# EAGLE design controller (EAGLE 6.6.0)
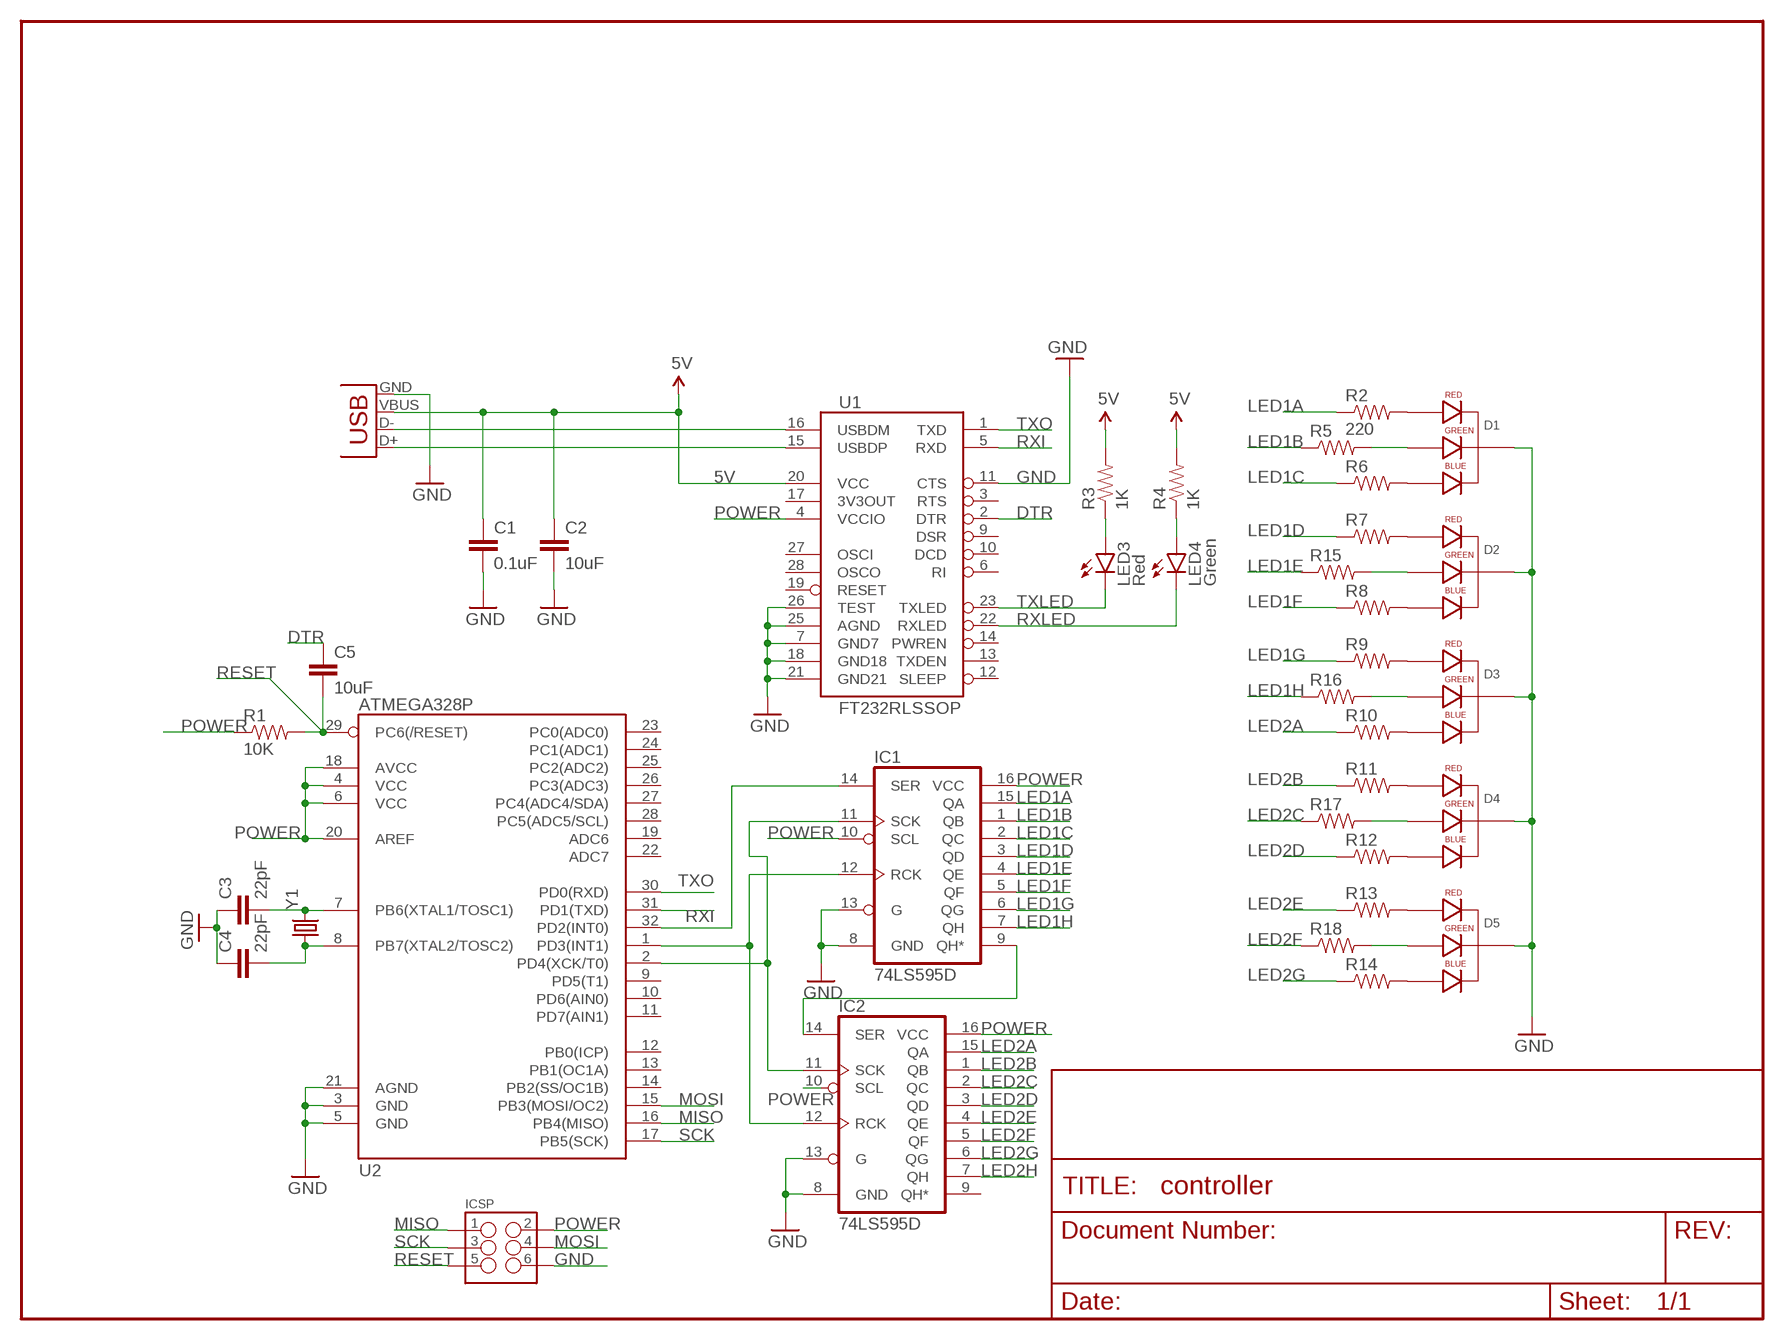
[diagram p0: schematic, sheet 1]

## Parts
C1  0.1uF  CAP0805  [0805]
C2  10uF  CAP0805  [0805]
C3  22pF  CAP0805  [0805]
C4  22pF  CAP0805  [0805]
C5  10uF  CAP0805  [0805]
D1  LED-RGB-CC-THRUDIFFUSE  [LED-RGB-THRU]
D2  LED-RGB-CC-THRUDIFFUSE  [LED-RGB-THRU]
D3  LED-RGB-CC-THRUDIFFUSE  [LED-RGB-THRU]
D4  LED-RGB-CC-THRUDIFFUSE  [LED-RGB-THRU]
D5  LED-RGB-CC-THRUDIFFUSE  [LED-RGB-THRU]
IC1  74LS595D  [SO16]
IC2  74LS595D  [SO16]
ICSP  M03X2POGO_PINS  [2X3_POGO]
LED3  Red  LED1206  [LED-1206]
LED4  Green  LED1206  [LED-1206]
R1  10K  RESISTOR0805-RES  [0805]
R2  220  RESISTOR0805-RES  [0805]
R3  1K  RESISTOR0805-RES  [0805]
R4  1K  RESISTOR0805-RES  [0805]
R5  RESISTOR0805-RES  [0805]
R6  RESISTOR0805-RES  [0805]
R7  RESISTOR0805-RES  [0805]
R8  RESISTOR0805-RES  [0805]
R9  RESISTOR0805-RES  [0805]
R10  RESISTOR0805-RES  [0805]
R11  RESISTOR0805-RES  [0805]
R12  RESISTOR0805-RES  [0805]
R13  RESISTOR0805-RES  [0805]
R14  RESISTOR0805-RES  [0805]
R15  RESISTOR0805-RES  [0805]
R16  RESISTOR0805-RES  [0805]
R17  RESISTOR0805-RES  [0805]
R18  RESISTOR0805-RES  [0805]
U1  FT232RLSSOP  [SSOP28DB]
U2  ATMEGA328P  ATMEGA328_SMT  [TQFP32-08]
X2  USB-SMD-NS  [USB-MINIB-NOSTOP]
Y1  CRYSTALHC49US  [HC49US]

## Nets
5V: C1.1 C2.1 R3.2 R4.2 U1.20(VCC) X2.VBUS
DTR: C5.1 U1.2(DTR)
GND [power]: C1.2 C2.2 C3.1 C4.1 D1.2(CATHODE) D2.2(CATHODE) D3.2(CATHODE) D4.2(CATHODE) D5.2(CATHODE) IC1.8(GND) IC1.13(G) IC2.8(GND) IC2.13(G) ICSP.P$6 U1.7(GND7) U1.11(CTS) U1.18(GND18) U1.21(GND21) U1.25(AGND) U1.26(TEST) U2.3(GND) U2.5(GND) U2.21(AGND) X2.GND
LED1A: IC1.15(QA) R2.1
LED1B: IC1.1(QB) R5.1
LED1C: IC1.2(QC) R6.1
LED1D: IC1.3(QD) R7.1
LED1E: IC1.4(QE) R15.1
LED1F: IC1.5(QF) R8.1
LED1G: IC1.6(QG) R9.1
LED1H: IC1.7(QH) R16.1
LED2A: IC2.15(QA) R10.1
LED2B: IC2.1(QB) R11.1
LED2C: IC2.2(QC) R17.1
LED2D: IC2.3(QD) R12.1
LED2E: IC2.4(QE) R13.1
LED2F: IC2.5(QF) R18.1
LED2G: IC2.6(QG) R14.1
LED2H: IC2.7(QH)
MISO: ICSP.P$1 U2.16(PB4(MISO))
MOSI: ICSP.P$4 U2.15(PB3(MOSI/OC2))
N$1: LED3.A R3.1
N$2: LED4.A R4.1
N$3: IC1.9(QH*) IC2.14(SER)
N$4: IC1.14(SER) U2.32(PD2(INT0))
N$5: IC1.12(RCK) IC2.12(RCK) U2.1(PD3(INT1))
N$6: IC1.11(SCK) IC2.11(SCK) U2.2(PD4(XCK/T0))
N$7: C3.2 U2.7(PB6(XTAL1/TOSC1)) Y1.2
N$8: C4.2 U2.8(PB7(XTAL2/TOSC2)) Y1.1
N$9: D1.1(RED_CATHODE) R2.2
N$10: D1.4(BLUE_CATHODE) R6.2
N$11: D2.1(RED_CATHODE) R7.2
N$12: D2.4(BLUE_CATHODE) R8.2
N$13: D3.1(RED_CATHODE) R9.2
N$14: D3.4(BLUE_CATHODE) R10.2
N$15: D4.1(RED_CATHODE) R11.2
N$16: D4.4(BLUE_CATHODE) R12.2
N$17: D5.1(RED_CATHODE) R13.2
N$18: D5.4(BLUE_CATHODE) R14.2
N$19: D1.3(GREEN_CATHODE) R5.2
N$20: D2.3(GREEN_CATHODE) R15.2
N$21: D3.3(GREEN_CATHODE) R16.2
N$22: D4.3(GREEN_CATHODE) R17.2
N$23: D5.3(GREEN_CATHODE) R18.2
POWER: IC1.10(SCL) IC1.16(VCC) IC2.10(SCL) IC2.16(VCC) ICSP.P$2 R1.1 U1.4(VCCIO) U2.4(VCC) U2.6(VCC) U2.18(AVCC) U2.20(AREF)
RESET: C5.2 ICSP.P$5 R1.2 U2.29(PC6(/RESET))
RXI: U1.5(RXD) U2.31(PD1(TXD))
RXLED: LED4.C U1.22(RXLED)
SCK: ICSP.P$3 U2.17(PB5(SCK))
TXLED: LED3.C U1.23(TXLED)
TXO: U1.1(TXD) U2.30(PD0(RXD))
USB_D+: U1.15(USBDP) X2.D+
USB_D-: U1.16(USBDM) X2.D-
Unconnected: IC2.9(QH*) U1.3(RTS) U1.6(RI) U1.9(DSR) U1.10(DCD) U1.12(SLEEP) U1.13(TXDEN) U1.14(PWREN) U1.17(3V3OUT) U1.19(RESET) U1.27(OSCI) U1.28(OSCO) U2.9(PD5(T1)) U2.10(PD6(AIN0)) U2.11(PD7(AIN1)) U2.12(PB0(ICP)) U2.13(PB1(OC1A)) U2.14(PB2(SS/OC1B)) U2.19(ADC6) U2.22(ADC7) U2.23(PC0(ADC0)) U2.24(PC1(ADC1)) U2.25(PC2(ADC2)) U2.26(PC3(ADC3)) U2.27(PC4(ADC4/SDA)) U2.28(PC5(ADC5/SCL))

## Library data of the parts
C1-C5 = SparkFun-Capacitors:CAP: Capacitor Standard 0603 ceramic capacitor, and 0.1" leaded capacitor.
D1-D5 = SparkFun-LED:LED-RGB-CC-THRU: RGB Through-hole common cathode LED SparkFun Storefront: COM-00105 (Clear) COM-09264 (Diffuse); PROD_ID: DIO-09434
IC1 IC2 = SparkFun-DigitalIC:74*595: 8-bit SHIFT REGISTER, output latch; PROD_ID: IC-07875
ICSP = SparkFun-Connectors:M03X2: 2x3 .1" header. Shrouded, with keying- CONN-10681 SMT- CONN-11415 Pogo pins- HW-11044; PROD_ID: HW-11044
LED3 LED4 = SparkFun-LED:LED: LEDs Standard schematic elements and footprints for 5mm, 3mm, 1206, and 0603 sized LEDs. 5mm - Spark Fun Electronics SKU : COM-00529 (and others)
R1-R18 = SparkFun-Resistors:RESISTOR: Resistor Basic schematic elements and footprints for 0603, 1206, and PTH resistors.
U1 = SparkFun:FT232RL: USB UART FT232RL 4th Generation USB UART (USB <-> Serial) Controller. Spark Fun Electronics SKU : COM-00650
U2 = SparkFun-DigitalIC:ATMEGA328_SMT: 32-Pin Atmega328 part Commonly used on Arduino compatible boards Available in QFP and QFN packages TQFP is IC-09069 QFN is non-stock; PROD_ID: IC-09069
X2 = SparkFun:USB: USB Connectors USB-B-PTH is fully proven SKU : PRT-00139 USB-miniB is fully proven SKU : PRT-00587 USB-A-PCB is untested. USB-A-H is throughly reviewed, but untested. Spark Fun Electronics SKU : PRT-00437 USB-B-SMT is throughly reviewed, but untested. Needs silkscreen touching up. USB-A-S has not been used/tested USB-MB-H has not been used/tested
Y1 = SparkFun-FreqCtrl:CRYSTAL: Various standard crystals. Proven footprints. Spark Fun Electronics SKU : COM-00534

## Net classes
0 default: width 0.203 mm
1 power: width 0.254 mm

## Board
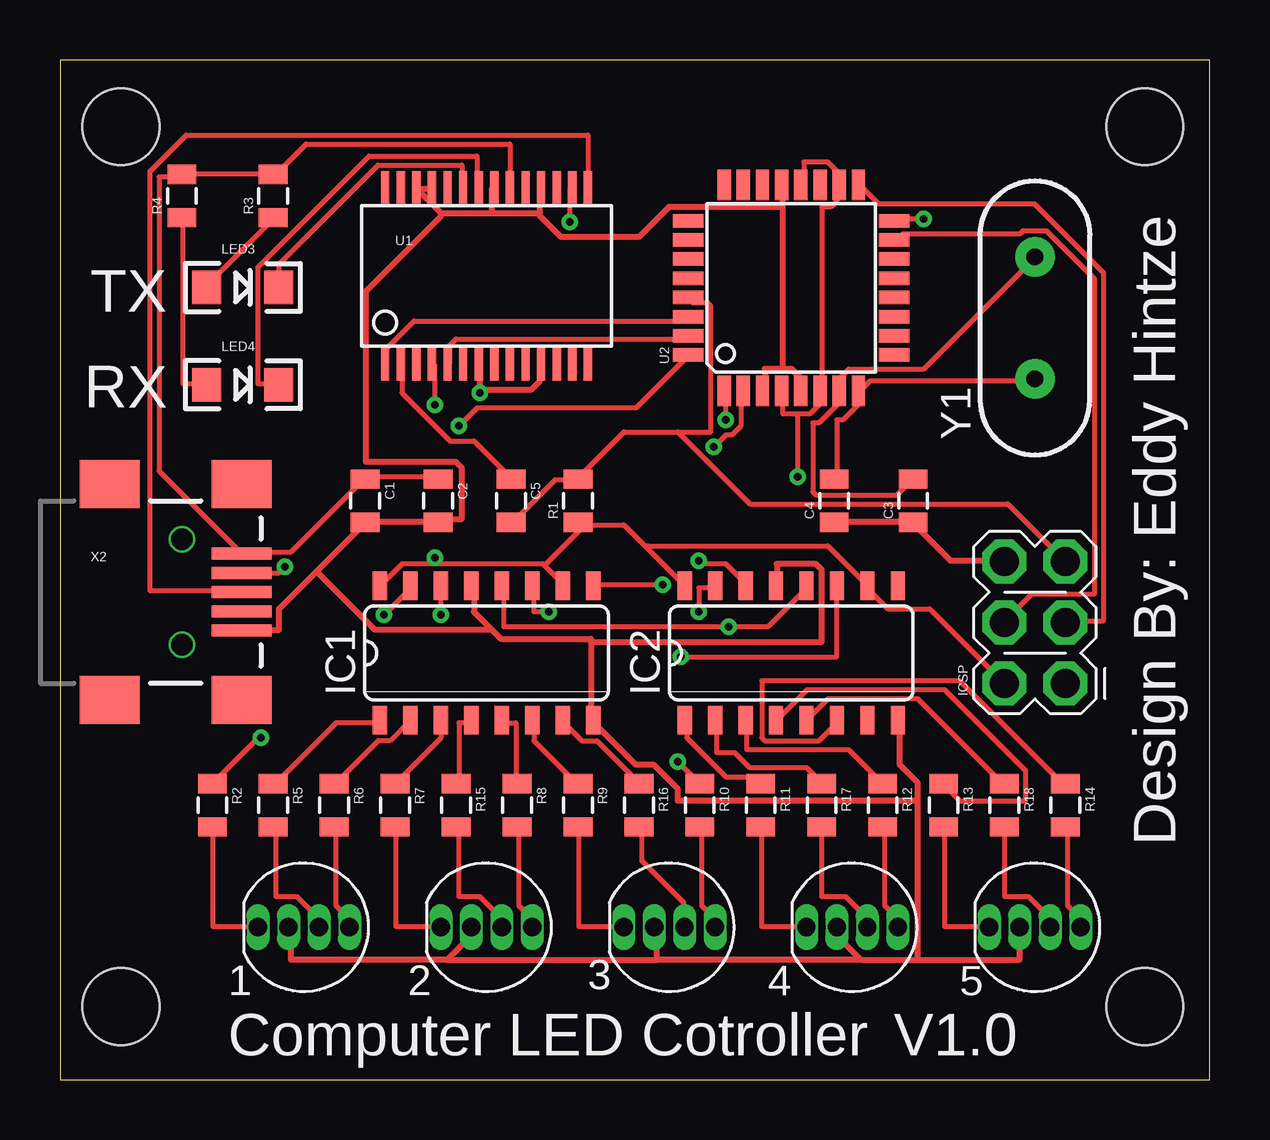
[diagram p1: board, top side]
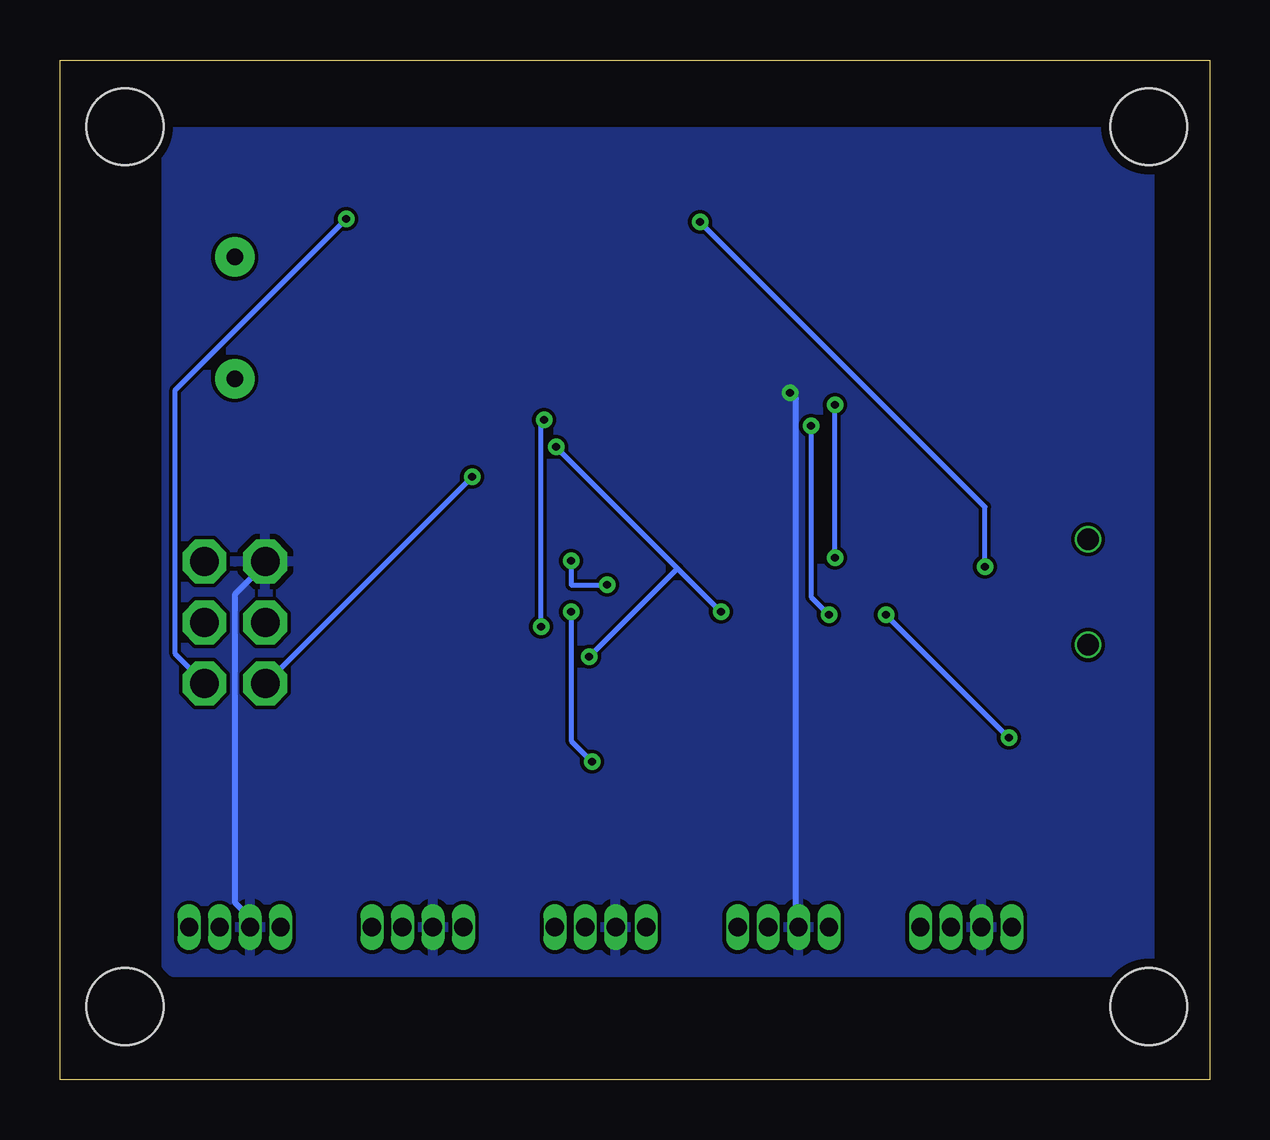
[diagram p2: board, bottom side, seen from below]

Size 47.93 x 42.5 mm. Coordinates in mm from the lower left corner, seen from the top.
Outline: 0,0 47.93,0 47.93,42.5 0,42.5 0,0
Copper layers (1*16): Top 0.0356mm / dielectric 1.5011mm / Bottom 0.0356mm
Design rules "LaenPCBOrder *": minimum track width 6mil, minimum drill 13mil, track to track 6mil, track to pad 6mil, pad to pad 6mil, via to via 6mil, smd to smd 6mil, copper to edge 15mil, drill to drill 6mil, minimum pad ring 4mil, minimum via ring 7mil, stop-mask expansion 3mil, vias tented up to drill 0mil, thermal gap 10mil
Holes 3.2 mm at 2.54,3.04 45.22,3.04 2.54,39.72 45.22,39.72

### Footprints (pad centres in the part's own frame; a part is rotated, then mirrored left to right if it is on the bottom)
0805 = smd 0.8 x 1.2: 1 -0.9,0; 2 0.9,0
LED-RGB-THRU = drill 0.762 pad 0.889 long: 1 1.905,0; 2 0.635,0; 3 -0.635,0; 4 -1.905,0
SO16 = smd 0.6 x 1.2: 1 -4.445,-2.8; 2 -3.175,-2.8; 3 -1.905,-2.8; 4 -0.635,-2.8; 5 0.635,-2.8; 6 1.905,-2.8; 7 3.175,-2.8; 8 4.445,-2.8; 9 4.445,2.8; 10 3.175,2.8; 11 1.905,2.8; 12 0.635,2.8; 13 -0.635,2.8; 14 -1.905,2.8; 15 -3.175,2.8; 16 -4.445,2.8
2X3_POGO = drill 1.2 pad 1.829 octagon: P$1 0,0; P$2 0,2.54; P$3 2.54,0; P$4 2.54,2.54; P$5 5.08,0; P$6 5.08,2.54
LED-1206 = smd 1.2 x 1.4: A -1.5,0; C 1.5,0
SSOP28DB = smd 0.348 x 1.397: 1 -4.225,-3.656; 2 -3.575,-3.656; 3 -2.925,-3.656; 4 -2.275,-3.656; 5 -1.625,-3.656; 6 -0.975,-3.656; 7 -0.325,-3.656; 8 0.325,-3.656; 9 0.975,-3.656; 10 1.625,-3.656; 11 2.275,-3.656; 12 2.925,-3.656; 13 3.575,-3.656; 14 4.225,-3.656; 15 4.225,3.656; 16 3.575,3.656; 17 2.925,3.656; 18 2.275,3.656; 19 1.625,3.656; 20 0.975,3.656; 21 0.325,3.656; 22 -0.325,3.656; 23 -0.975,3.656; 24 -1.625,3.656; 25 -2.275,3.656; 26 -2.925,3.656; 27 -3.575,3.656; 28 -4.225,3.656
TQFP32-08 = smd 1.27 x 0.559: 1 -4.293,2.8; 2 -4.293,2; 3 -4.293,1.2; 4 -4.293,0.4; 5 -4.293,-0.4; 6 -4.293,-1.2; 7 -4.293,-2; 8 -4.293,-2.8; 17 4.293,-2.8; 18 4.293,-2; 19 4.293,-1.2; 20 4.293,-0.4; 21 4.293,0.4; 22 4.293,1.2; 23 4.293,2; 24 4.293,2.8 | smd 0.559 x 1.27: 9 -2.8,-4.293; 10 -2,-4.293; 11 -1.2,-4.293; 12 -0.4,-4.293; 13 0.4,-4.293; 14 1.2,-4.293; 15 2,-4.293; 16 2.8,-4.293; 25 2.8,4.293; 26 2,4.293; 27 1.2,4.293; 28 0.4,4.293; 29 -0.4,4.293; 30 -1.2,4.293; 31 -2,4.293; 32 -2.8,4.293
USB-MINIB-NOSTOP = smd 2.5 x 0.5: D+ 2.5,0; D- 2.5,0.8; GND 2.5,-1.6; ID 2.5,-0.8; VBUS 2.5,1.6 | smd 2.5 x 2: G1 -3,-4.5; G2 -3,4.5; G3 2.5,4.5; G4 2.5,-4.5 | drill 0.9 pad 0.8: H1 0,2.2 | drill 0.9 pad 0.787: H2 0,-2.2
HC49US = drill 0.7 pad 1.651: 1 -2.54,0; 2 2.54,0

### Placement (x,y rotation side)
C1  12.72,24.13 270 top
C2  15.76,24.13 270 top
C3  35.56,24.13 90 top
C4  32.27,24.13 90 top
C5  18.8,24.13 270 top
D1  10.16,6.35 180 top
D2  17.78,6.35 180 top
D3  25.4,6.35 180 top
D4  33.02,6.35 180 top
D5  40.64,6.35 180 top
IC1  17.78,17.78 0 top
IC2  30.48,17.78 0 top
ICSP  41.91,16.51 90 top
LED3  7.62,33.02 0 top
LED4  7.62,28.96 0 top
R1  21.59,24.13 90 top
R2  6.35,11.43 270 top
R3  8.89,36.83 90 top
R4  5.08,36.83 90 top
R5  8.89,11.43 270 top
R6  11.43,11.43 270 top
R7  13.97,11.43 270 top
R8  19.05,11.43 270 top
R9  21.59,11.43 270 top
R10  26.67,11.43 270 top
R11  29.21,11.43 270 top
R12  34.29,11.43 270 top
R13  36.83,11.43 270 top
R14  41.91,11.43 270 top
R15  16.51,11.43 270 top
R16  24.13,11.43 270 top
R17  31.75,11.43 270 top
R18  39.37,11.43 270 top
U1  17.78,33.5 0 top
U2  30.48,33 90 top
X2  5.08,20.32 0 top
Y1  40.64,31.75 90 top

### Tracks (layer width: path | path; a pad name or v marks a point on that pad's centre or on a via)
5V
  Top 0.203: C2.1 15.75,25.12 12.75,25.12 C1.1 12.62,25 9.62,22 7.62,22 X2.VBUS 4.12,25.38 4.12,37.62 5,37.62 R4.2 5.12,37.75 8.88,37.75 R3.2 9,37.75 10.25,39 18.75,39 18.75,37.25 U1.20
DTR
  Top 0.203: C5.1 18.75,25.12 17.25,26.62 16.25,26.62 14.25,28.62 14.25,29.75 U1.2
GND  (via drill 0.33)
  Top 0.254: U1.25 15.5,37.12 14.88,37.12 U1.26 15,37 15.88,36.12 | 18,36.12 18,37.12 U1.21 | 15.88,36.12 18,36.12 | 20,36.12 20,37.12 U1.18 | 18,36.12 20,36.12 | 30.12,29.62 30.5,29.62 30.88,29.25 30.88,28.75 U2.5 | 30.12,29.62 29.38,29.62 29.38,28.75 U2.3 | 30.12,29.62 30.12,36.38 | 30.12,36.38 30.12,37.25 U2.21 | 30.12,36.38 25.38,36.38 24.12,35.12 20.88,35.12 20,36 20,36.12 | 10.69,21.19 9.12,19.62 9.12,18.75 7.62,18.75 X2.GND | 10.69,21.19 12.62,23.12 C1.2 12.75,23.25 15.75,23.25 C2.2 15.75,23.38 16.75,23.38 16.75,25.5 16.5,25.75 12.75,25.75 12.75,32.88 15.88,36 15.88,36.12 | 22.12,18.25 22.12,18.38 18.38,18.38 17.94,18.81 | 22.12,18.25 22.12,15 IC1.8 22.25,14.88 24,13.12 24.75,13.12 25.75,12.12 25.75,11.62 35.75,11.62 | 17.94,18.81 17.25,19.5 17.25,20.5 IC1.13 | 22.12,18.25 31.75,18.25 31.75,21.25 31.5,21.5 29.88,21.5 29.88,20.62 IC2.13 | 10.69,21.19 13.12,18.75 17.88,18.75 17.94,18.81 | C4.1 32.38,23.25 35.5,23.25 C3.1 35.62,23.12 37.12,21.62 39.25,21.62 ICSP.P$6 | 35.75,5 35.75,11.62 | 35.75,11.62 35.75,12.38 35,13.12 35,14.88 IC2.8 | 33.38,5 35.75,5 | 33.38,5 32.5,5.88 32.5,6.25 D4.2 | 24.88,5 24.88,6.25 D3.2 | 33.38,5 24.88,5 | 35.75,5 40,5 40,6.25 D5.2 | 17.5,28.75 17.5,29.75 U1.7 | 17.5,28.75 19.62,28.75 20,29.12 20,29.75 U1.11 | 16.12,5 9.62,5 9.62,6.25 D1.2 | 16.12,5 17.12,6 17.12,6.25 D2.2 | v17.5,28.62 17.5,28.75 | 16.12,5 24.88,5
  Bottom 0.254: ICSP.P$6 39.38,21.5 40.62,20.25 40.62,7.38 40.12,6.88 40.12,6.38 D5.2 | v17.5,28.62 17.25,28.38 17.25,6.38 D2.2
  pour Bottom: 2.5,39.5 43.5,39.5 43.5,4.75 43.25,4.5 2.75,4.5 2.5,4.75
LED1A  (via drill 0.33)
  Top 0.203: v8.38,14.25 8.25,14.25 6.38,12.38 R2.1 | v13.5,19.38 14.62,20.5 IC1.15
  Bottom 0.203: v13.5,19.38 v8.38,14.25
LED1B
  Top 0.203: R5.1 9,12.38 11.5,14.88 13.25,14.88 IC1.1
LED1C
  Top 0.203: IC1.2 13.75,14.12 13.25,14.12 11.5,12.38 R6.1
LED1D
  Top 0.203: IC1.3 15.88,14.25 14,12.38 R7.1
LED1E
  Top 0.203: R15.1 16.62,12.38 16.62,14.88 17.12,14.88 IC1.4
LED1F
  Top 0.203: R8.1 19,12.38 19,14.88 18.5,14.88 IC1.5
LED1G
  Top 0.203: R9.1 21.5,12.38 19.75,14.12 19.75,14.88 IC1.6
LED1H
  Top 0.203: R16.1 24.12,12.38 22.38,14.12 21.75,14.12 21,14.88 IC1.7
LED2A  (via drill 0.33)
  Top 0.203: v25.75,13.25 R10.1 | v26.62,19.5 26.62,20.5 27.25,20.5 IC2.15
  Bottom 0.203: v25.75,13.25 26.62,14.12 v26.62,19.5
LED2B
  Top 0.203: R11.1 29.12,12.38 28.88,12.62 27.75,12.62 26.12,14.25 26.12,14.88 IC2.1
LED2C
  Top 0.203: IC2.2 27.38,14.88 27.38,13.62 28.12,13.62 28.75,13 31.12,13 31.75,12.38 R17.1
LED2D
  Top 0.203: IC2.3 28.62,14.88 28.62,13.75 32.88,13.75 34.25,12.38 R12.1
LED2E
  Top 0.203: IC2.4 29.88,15 31.12,16.25 36.88,16.25 40.25,12.88 40.25,11.62 37.5,11.62 36.88,12.25 R13.1
LED2F
  Top 0.203: IC2.5 31.12,15 32,15.88 35.75,15.88 39.25,12.38 R18.1
LED2G
  Top 0.203: IC2.6 32.38,14.88 31.62,14.12 29.38,14.12 29.25,14.25 29.25,16.62 37.5,16.62 41.75,12.38 41.88,12.38 R14.1
MISO  (via drill 0.33)
  Top 0.203: v36,35.88 34.88,35.88 U2.16
  Bottom 0.203: v36,35.88 43.12,28.75 43.12,17.75 42,16.62 ICSP.P$1
MOSI
  Top 0.203: U2.15 34.88,35 35.12,35.25 40,35.25 40.12,35.38 41.12,35.38 43.12,33.38 43.12,20.25 40.5,20.25 39.38,19.12 ICSP.P$4
N$1
  Top 0.203: R3.1 8.88,35.88 6.12,33.12 LED3.A
N$2
  Top 0.203: R4.1 5.12,35.88 5.12,29 6,29 LED4.A
N$3  (via drill 0.33)
  Top 0.203: v25.12,20.62 22.25,20.62 IC1.9 | v26.62,21.62 26.75,21.5 27.75,21.5 28.62,20.62 IC2.14
  Bottom 0.203: v25.12,20.62 26.62,20.62 v26.62,21.62
N$4  (via drill 0.33)
  Top 0.203: v15.88,19.38 IC1.14 | v16.62,27.25 17.38,28 24,28 26.12,30.12 U2.32
  Bottom 0.203: v15.88,19.38 16.62,20.12 v16.62,27.25
N$5  (via drill 0.33)
  Top 0.203: IC1.12 18.5,20.5 18.5,18.88 v27.88,18.88 29.5,18.88 31.12,20.5 IC2.12 | v27.75,27.5 27.75,28.62 U2.1
  Bottom 0.203: v27.75,27.5 27.88,27.38 v27.88,18.88
N$6  (via drill 0.33)
  Top 0.203: v20.38,19.5 19.75,19.5 19.75,20.5 IC1.11 | v27.25,26.38 27.75,26.88 28,26.88 28.38,27.25 28.38,28.62 U2.2 | v25.88,17.62 32.38,17.62 32.38,20.5 IC2.11
  Bottom 0.203: v27.25,26.38 22.19,21.31 | 22.19,21.31 v20.38,19.5 | 22.19,21.31 v25.88,17.62
N$7
  Top 0.203: C3.2 35.5,25 34.88,24.38 31.5,24.38 31.38,24.5 31.38,27.38 31.62,27.38 32.38,28.12 32.38,28.62 U2.7 32.5,28.75 32.5,29.25 32.88,29.62 36,29.62 40.62,34.25 Y1.2
N$8
  Top 0.203: C4.2 32.38,25.12 32.38,27.5 32.62,27.5 33.25,28.12 33.25,28.62 U2.8 33.38,28.75 33.75,29.12 40.62,29.12 Y1.1
N$9
  Top 0.203: R2.2 6.38,10.5 6.38,6.38 8.25,6.38 D1.1
N$10
  Top 0.203: R6.2 11.5,10.5 11.5,7.25 12,6.75 12,6.38 D1.4
N$11
  Top 0.203: R7.2 14,10.5 14,6.38 15.88,6.38 D2.1
N$12
  Top 0.203: R8.2 19.12,10.5 19.12,7.25 19.62,6.75 19.62,6.38 D2.4
N$13
  Top 0.203: R9.2 21.62,10.5 21.62,6.38 23.38,6.38 D3.1
N$14
  Top 0.203: R10.2 26.75,10.5 26.75,7.25 27.25,6.75 27.25,6.38 D3.4
N$15
  Top 0.203: R11.2 29.25,10.5 29.25,6.38 31,6.38 D4.1
N$16
  Top 0.203: R12.2 34.38,10.5 34.38,7.25 34.88,6.75 34.88,6.38 D4.4
N$17
  Top 0.203: R13.2 36.88,10.5 36.88,6.38 38.62,6.38 D5.1
N$18
  Top 0.203: R14.2 42,10.5 42,7.25 42.5,6.75 42.5,6.38 D5.4
N$19
  Top 0.203: R5.2 9,10.5 9,7.62 9.88,7.62 10.75,6.75 10.75,6.38 D1.3
N$20
  Top 0.203: R15.2 16.62,10.5 16.62,7.62 17.5,7.62 18.38,6.75 18.38,6.38 D2.3
N$21
  Top 0.203: R16.2 24.25,10.5 24.25,9.12 26,7.38 26,6.38 D3.3
N$22
  Top 0.203: R17.2 31.75,7.62 32.75,7.62 33.62,6.75 33.62,6.38 D4.3
N$23
  Top 0.203: R18.2 39.38,10.5 39.38,7.62 40.38,7.62 41.25,6.75 41.25,6.38 D5.3
POWER  (via drill 0.33)
  Top 0.203: 15.62,21.5 20.12,21.5 20.19,21.44 | 15.62,21.5 14.25,21.5 13.38,20.62 IC1.16 | 20.19,21.44 21,20.62 IC1.10 | v15.62,28.12 15.62,29.75 U1.4 | 15.62,21.5 v15.62,21.75 | 30.75,27.75 31.25,27.75 31.62,28.12 31.62,28.62 U2.6 31.75,28.75 31.75,36.38 32.12,36.38 32.38,36.62 32.38,37.25 U2.18 32.38,37.38 32.38,37.88 32,38.25 31,38.25 31,37.38 U2.20 | 30.75,27.75 30.12,27.75 30.12,28.62 U2.4 | 24.44,22.19 23.5,23.12 21.88,23.12 | 24.44,22.19 26,20.62 IC2.16 | 21.88,23.12 21.62,23.12 R1.1 21.88,23.12 | 24.44,22.19 24.5,22.25 32,22.25 33.62,20.62 IC2.10 33.62,20.5 34.5,19.62 36.25,19.62 39.25,16.62 ICSP.P$2 | v30.75,25.12 30.75,27.75 | 21.88,23.12 20.19,21.44
  Bottom 0.203: v15.62,21.75 v15.62,28.12 | v30.75,25.12 39.25,16.62 ICSP.P$2
RESET
  Top 0.203: C5.2 18.88,23.25 20.62,25 21.5,25 R1.2 21.62,25.12 23.5,27 25.75,27 | 25.75,27 27.12,27 27.12,32.25 27,32.38 26.38,32.38 26.25,32.5 U2.29 | ICSP.P$5 39.5,24 28.75,24 25.75,27
RXI
  Top 0.203: U2.31 26.12,31 26,30.88 16.5,30.88 16.25,30.62 16.25,29.88 U1.5
RXLED
  Top 0.203: U1.22 17.38,37.25 17.38,38.5 12.88,38.5 8.25,33.88 8.25,29 9,29 LED4.C
SCK
  Top 0.203: U2.17 33.38,37.25 34.12,36.5 40.62,36.5 43.5,33.62 43.5,19.12 42,19.12 ICSP.P$3
TXLED
  Top 0.203: U1.23 16.75,37.25 16.75,38.12 13.25,38.12 9.12,34 9.12,33.12 LED3.C
TXO
  Top 0.203: U2.30 26.12,31.75 26,31.62 14.75,31.62 13.62,30.5 13.62,29.88 U1.1
USB_D+
  Top 0.203: U1.15 22,37.25 22,39.38 5.25,39.38 3.75,37.88 3.75,20.38 7.5,20.38 X2.D+
USB_D-  (via drill 0.33)
  Top 0.203: v21.25,35.75 21.25,37.12 U1.16 | v9.38,21.38 9.12,21.12 7.62,21.12 X2.D-
  Bottom 0.203: v21.25,35.75 9.38,23.88 v9.38,21.38

### Text on the board
_tsilk: TX | RX | Design By: Eddy Hintze | 1 | 2 | 3 | 4 | 5 | Computer LED Cotroller | V1.0